# EAGLE design Main (EAGLE 9.6.2)

## Sheet 1 of 2
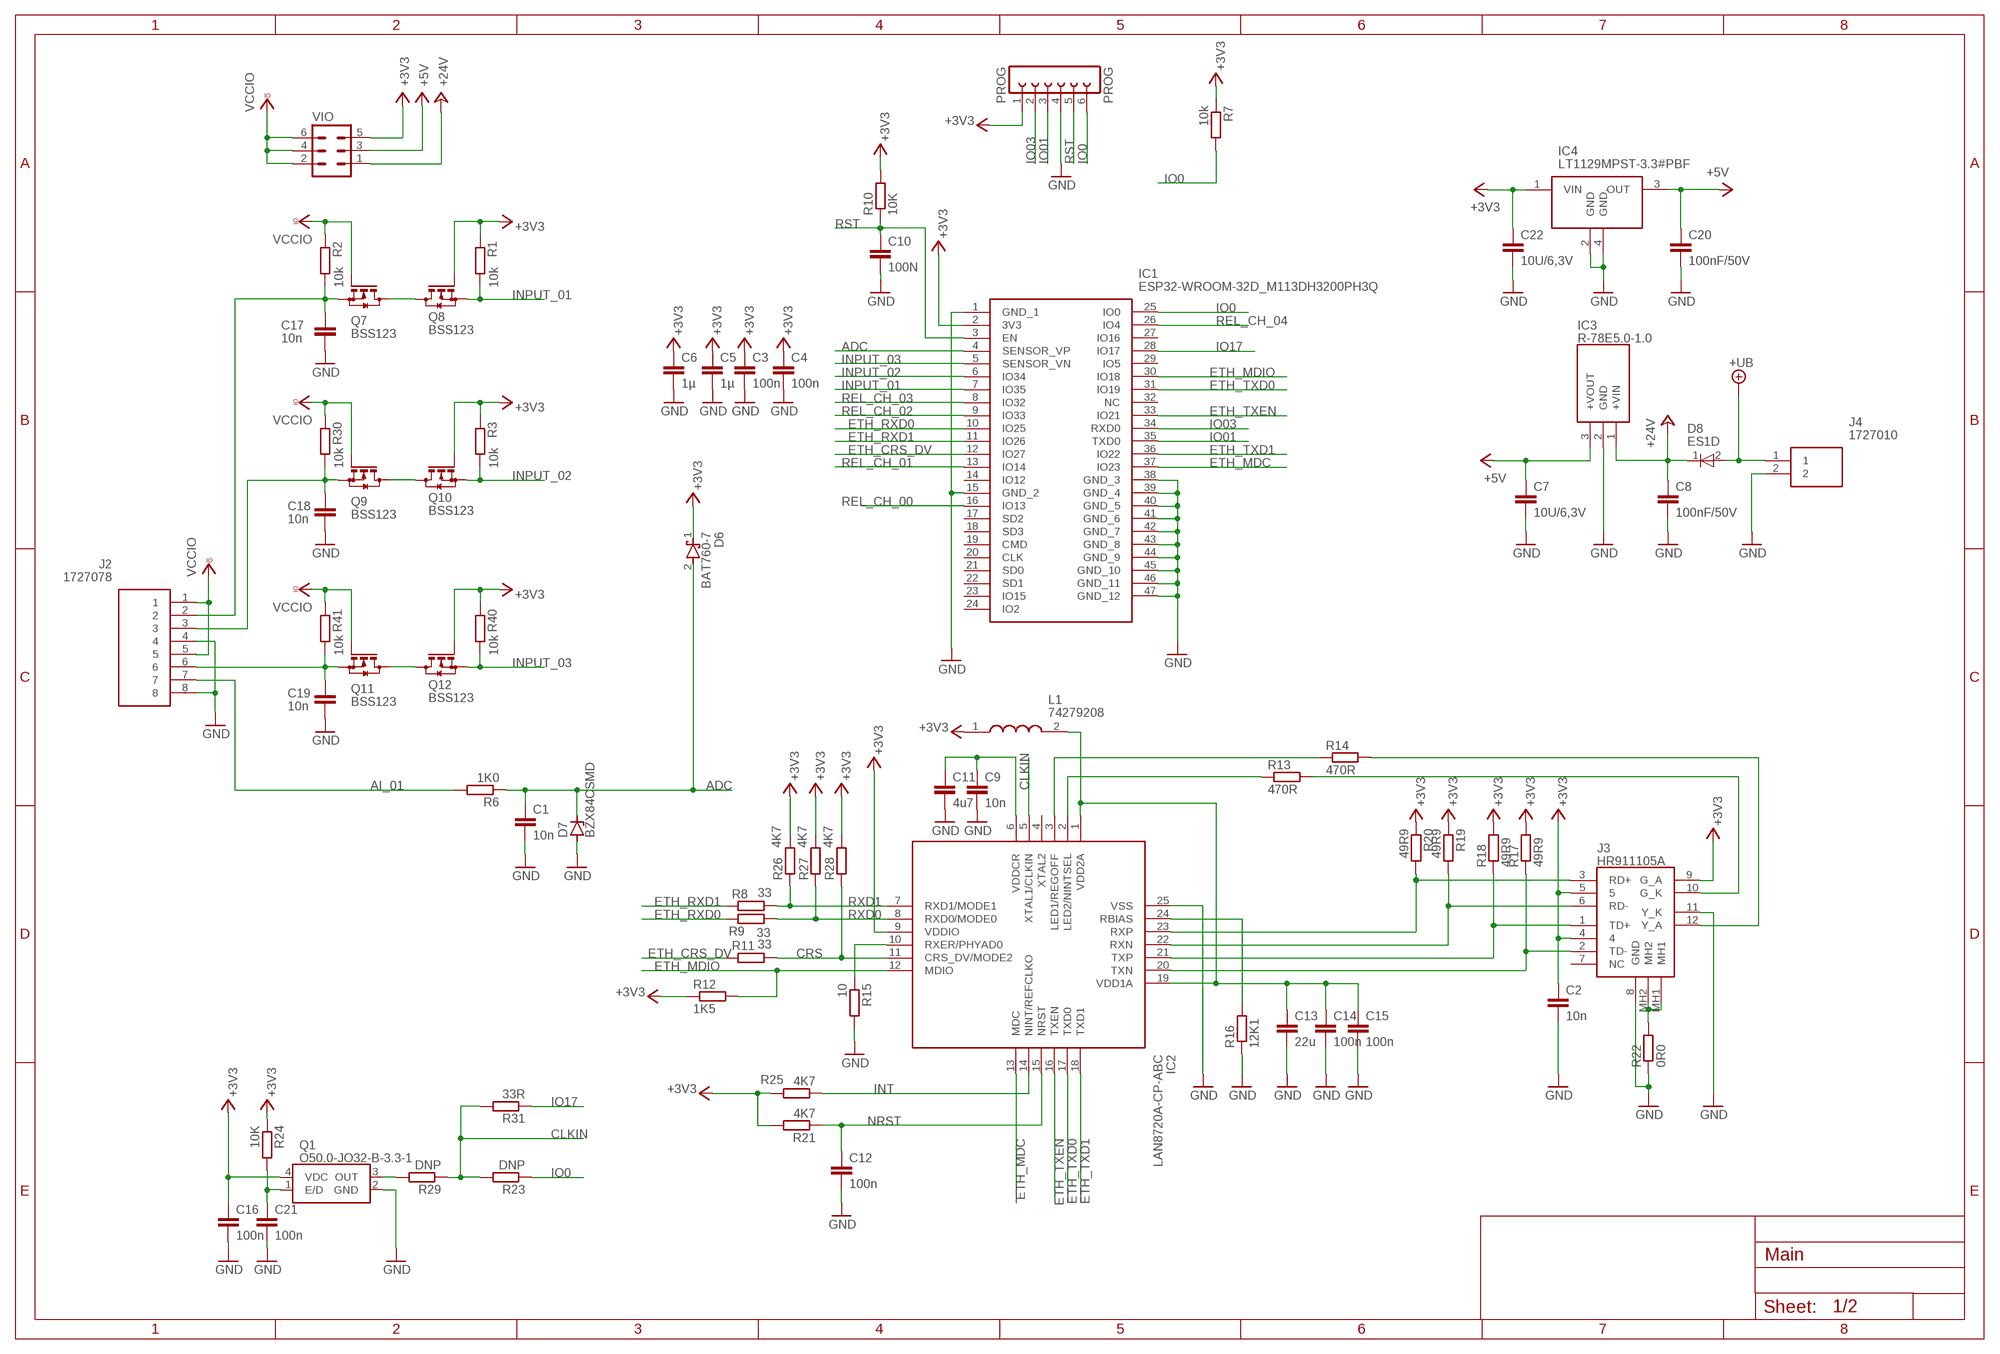
[diagram p0: schematic, sheet 1]

### Parts
C1  10n  C-EUC0603  [C0603]
C2  10n  C-EUC0603  [C0603]
C3  100n  C-EUC0603  [C0603]
C4  100n  C-EUC0603  [C0603]
C5  1µ  C-EUC0603  [C0603]
C6  1µ  C-EUC0603  [C0603]
C7  10U/6,3V  C-EUC0603  [C0603]
C8  100nF/50V  C-EUC0603  [C0603]
C9  10n  C-EUC0603  [C0603]
C10  100N  C-EUC0603  [C0603]
C11  4u7  C-EUC0603  [C0603]
C12  100n  C-EUC0603  [C0603]
C13  22u  C-EUC0603  [C0603]
C14  100n  C-EUC0603  [C0603]
C15  100n  C-EUC0603  [C0603]
C16  100n  C-EUC0603  [C0603]
C17  10n  C-EUC0603  [C0603]
C18  10n  C-EUC0603  [C0603]
C19  10n  C-EUC0603  [C0603]
C20  100nF/50V  C-EUC0603  [C0603]
C21  100n  C-EUC0603  [C0603]
C22  10U/6,3V  C-EUC0603  [C0603]
D6  BAT760-7  [SOD2513X120N]
D7  BZX84CSMD  [TO236]
D8  ES1D  ES1DL_R3G  [SODFL3618X143N]
IC1  ESP32-WROOM-32D_M113DH3200PH3Q  [ESP32WROOM32DM113DH3200PH3Q0]
IC2  LAN8720A-CP-ABC  [QFN50P400X400X100-25N]
IC3  R-78E5.0-1.0  R-78E3.3-1.0  [R78E3310]
IC4  LT1129MPST-3.3#PBF  [SOT230P700X180-4N]
J2  1727078  [1727078]
J3  HR911105A  [HR911105A]
J4  1727010  [1727010]
L1  74279208  [CAPC2012X90N]
PROG  PROG  FE06-1  [FE06]
Q1  O50.0-JO32-B-3.3-1  [O200JO32B1V31T1LF]
Q7  BSS123  [SOT23]
Q8  BSS123  [SOT23]
Q9  BSS123  [SOT23]
Q10  BSS123  [SOT23]
Q11  BSS123  [SOT23]
Q12  BSS123  [SOT23]
R1  10k  R-EU_R0603  [R0603]
R2  10k  R-EU_R0603  [R0603]
R3  10k  R-EU_R0603  [R0603]
R6  1K0  R-EU_R0603  [R0603]
R7  10k  R-EU_R0603  [R0603]
R8  33  R-EU_R0603  [R0603]
R9  33  R-EU_R0603  [R0603]
R10  10K  R-EU_R0603  [R0603]
R11  33  R-EU_R0603  [R0603]
R12  1K5  R-EU_R0603  [R0603]
R13  470R  R-EU_R0603  [R0603]
R14  470R  R-EU_R0603  [R0603]
R15  10  R-EU_R0603  [R0603]
R16  12K1  R-EU_R0603  [R0603]
R17  49R9  R-EU_R0603  [R0603]
R18  49R9  R-EU_R0603  [R0603]
R19  49R9  R-EU_R0603  [R0603]
R20  49R9  R-EU_R0603  [R0603]
R21  4K7  R-EU_R0603  [R0603]
R22  0R0  R-EU_R0603  [R0603]
R23  DNP  R-EU_R0603  [R0603]
R24  10K  R-EU_R0603  [R0603]
R25  4K7  R-EU_R0603  [R0603]
R26  4K7  R-EU_R0603  [R0603]
R27  4K7  R-EU_R0603  [R0603]
R28  4K7  R-EU_R0603  [R0603]
R29  DNP  R-EU_R0603  [R0603]
R30  10k  R-EU_R0603  [R0603]
R31  33R  R-EU_R0603  [R0603]
R40  10k  R-EU_R0603  [R0603]
R41  10k  R-EU_R0603  [R0603]
VIO  MA03-2  [MA03-2]

### Nets
+3V3: C2.1 C3.1 C4.1 C5.1 C6.1 C16.1 C22.1 D6.1(K) IC1.2(3V3) IC2.9(VDDIO) IC4.1(VIN) J3.4 J3.5 J3.9(G_A) L1.1 PROG.1 Q1.4(VDC) Q8.1(G) Q10.1(G) Q12.1(G) R1.1 R3.1 R7.1 R10.2 R12.1 R17.2 R18.2 R19.1 R20.1 R21.2 R24.1 R25.2 R26.2 R27.2 R28.2 R40.1 VIO.5
+5V: C7.1 C20.1 IC3.3(+VOUT) IC4.3(OUT) VIO.3 ; also sheet 2
+24V: C8.1 D8.1(K) IC3.1(+VIN) VIO.1
+UB: D8.2(A) J4.1 ; also sheet 2
ADC: C1.1 D6.2(A) D7.C IC1.4(SENSOR_VP) R6.1
AI_01: J2.7 R6.2
CLKIN: IC2.5(XTAL1/CLKIN) R23.2 R29.1 R31.2
CRS: IC2.11(CRS_DV/MODE2) R11.2 R28.1
ETH_CRS_DV: IC1.12(IO27) R11.1
ETH_MDC: IC1.37(IO23) IC2.13(MDC)
ETH_MDIO: IC1.30(IO18) IC2.12(MDIO) R12.2
ETH_PHY_PWR: C21.1 Q1.1(E/D) R24.2
ETH_RXD0: IC1.10(IO25) R9.1
ETH_RXD1: IC1.11(IO26) R8.1
ETH_TXD0: IC1.31(IO19) IC2.17(TXD0)
ETH_TXD1: IC1.36(IO22) IC2.18(TXD1)
ETH_TXEN: IC1.33(IO21) IC2.16(TXEN)
GND: C1.2 C2.2 C3.2 C4.2 C5.2 C6.2 C7.2 C8.2 C9.2 C10.2 C11.2 C12.2 C13.2 C14.2 C15.2 C16.2 C17.2 C18.2 C19.2 C20.2 C21.2 C22.2 D7.A IC1.1(GND_1) IC1.15(GND_2) IC1.38(GND_3) IC1.39(GND_4) IC1.40(GND_5) IC1.41(GND_6) IC1.42(GND_7) IC1.43(GND_8) IC1.44(GND_9) IC1.45(GND_10) IC1.46(GND_11) IC1.47(GND_12) IC2.25(VSS) IC3.2(GND) IC4.2(GND) IC4.4(GND.) J2.4 J2.8 J3.8(GND) J3.11(Y_K) J4.2 PROG.4 Q1.2(GND) R15.2 R16.1 R22.1 ; also sheet 2
INPUT_01: IC1.7(IO35) Q8.2(S) R1.2
INPUT_02: IC1.6(IO34) Q10.2(S) R3.2
INPUT_03: IC1.5(SENSOR_VN) Q12.2(S) R40.2
INT: IC2.14(NINT/REFCLKO) R25.1
IO0: IC1.25(IO0) PROG.6 R7.2 R23.1
IO01: IC1.35(TXD0) PROG.3
IO03: IC1.34(RXD0) PROG.2
IO17: IC1.28(IO17) R31.1
N$2: IC2.20(TXN) J3.2(TD-) R17.1
N$3: IC2.22(RXN) J3.6(RD-) R19.2
N$4: IC2.23(RXP) J3.3(RD+) R20.2
N$5: J3.12(Y_A) R14.2
N$6: J3.10(G_K) R13.2
N$8: Q1.3(OUT) R29.2
N$9: J3.MH1 J3.MH2 R22.2
N$13: Q7.3(D) Q8.3(D)
N$14: Q9.3(D) Q10.3(D)
N$16: C17.1 J2.2 Q7.2(S) R2.2
N$18: C13.1 C14.1 C15.1 IC2.1(VDD2A) IC2.19(VDD1A) L1.2
N$19: C9.1 C11.1 IC2.6(VDDCR)
N$20: IC2.2(LED2/NINTSEL) R13.1
N$21: IC2.3(LED1/REGOFF) R14.1
N$22: IC2.10(RXER/PHYAD0) R15.1
N$23: IC2.21(TXP) J3.1(TD+) R18.1
N$24: IC2.24(RBIAS) R16.2
N$26: C18.1 J2.3 Q9.2(S) R30.2
N$29: Q11.3(D) Q12.3(D)
N$30: C19.1 J2.6 Q11.2(S) R41.2
NRST: C12.1 IC2.15(NRST) R21.1
REL_CH_00: IC1.16(IO13) ; also sheet 2
REL_CH_01: IC1.13(IO14) ; also sheet 2
REL_CH_02: IC1.9(IO33) ; also sheet 2
REL_CH_03: IC1.8(IO32) ; also sheet 2
REL_CH_04: IC1.26(IO4) ; also sheet 2
RST: C10.1 IC1.3(EN) PROG.5 R10.1
RXD0: IC2.8(RXD0/MODE0) R9.2 R27.1
RXD1: IC2.7(RXD1/MODE1) R8.2 R26.1
VCCIO: J2.1 J2.5 Q7.1(G) Q9.1(G) Q11.1(G) R2.1 R30.1 R41.1 VIO.2 VIO.4 VIO.6
Unconnected: IC1.14(IO12) IC1.17(SD2) IC1.18(SD3) IC1.19(CMD) IC1.20(CLK) IC1.21(SD0) IC1.22(SD1) IC1.23(IO15) IC1.24(IO2) IC1.27(IO16) IC1.29(IO5) IC1.32(NC) IC2.4(XTAL2) J3.7(NC)

## Sheet 2 of 2
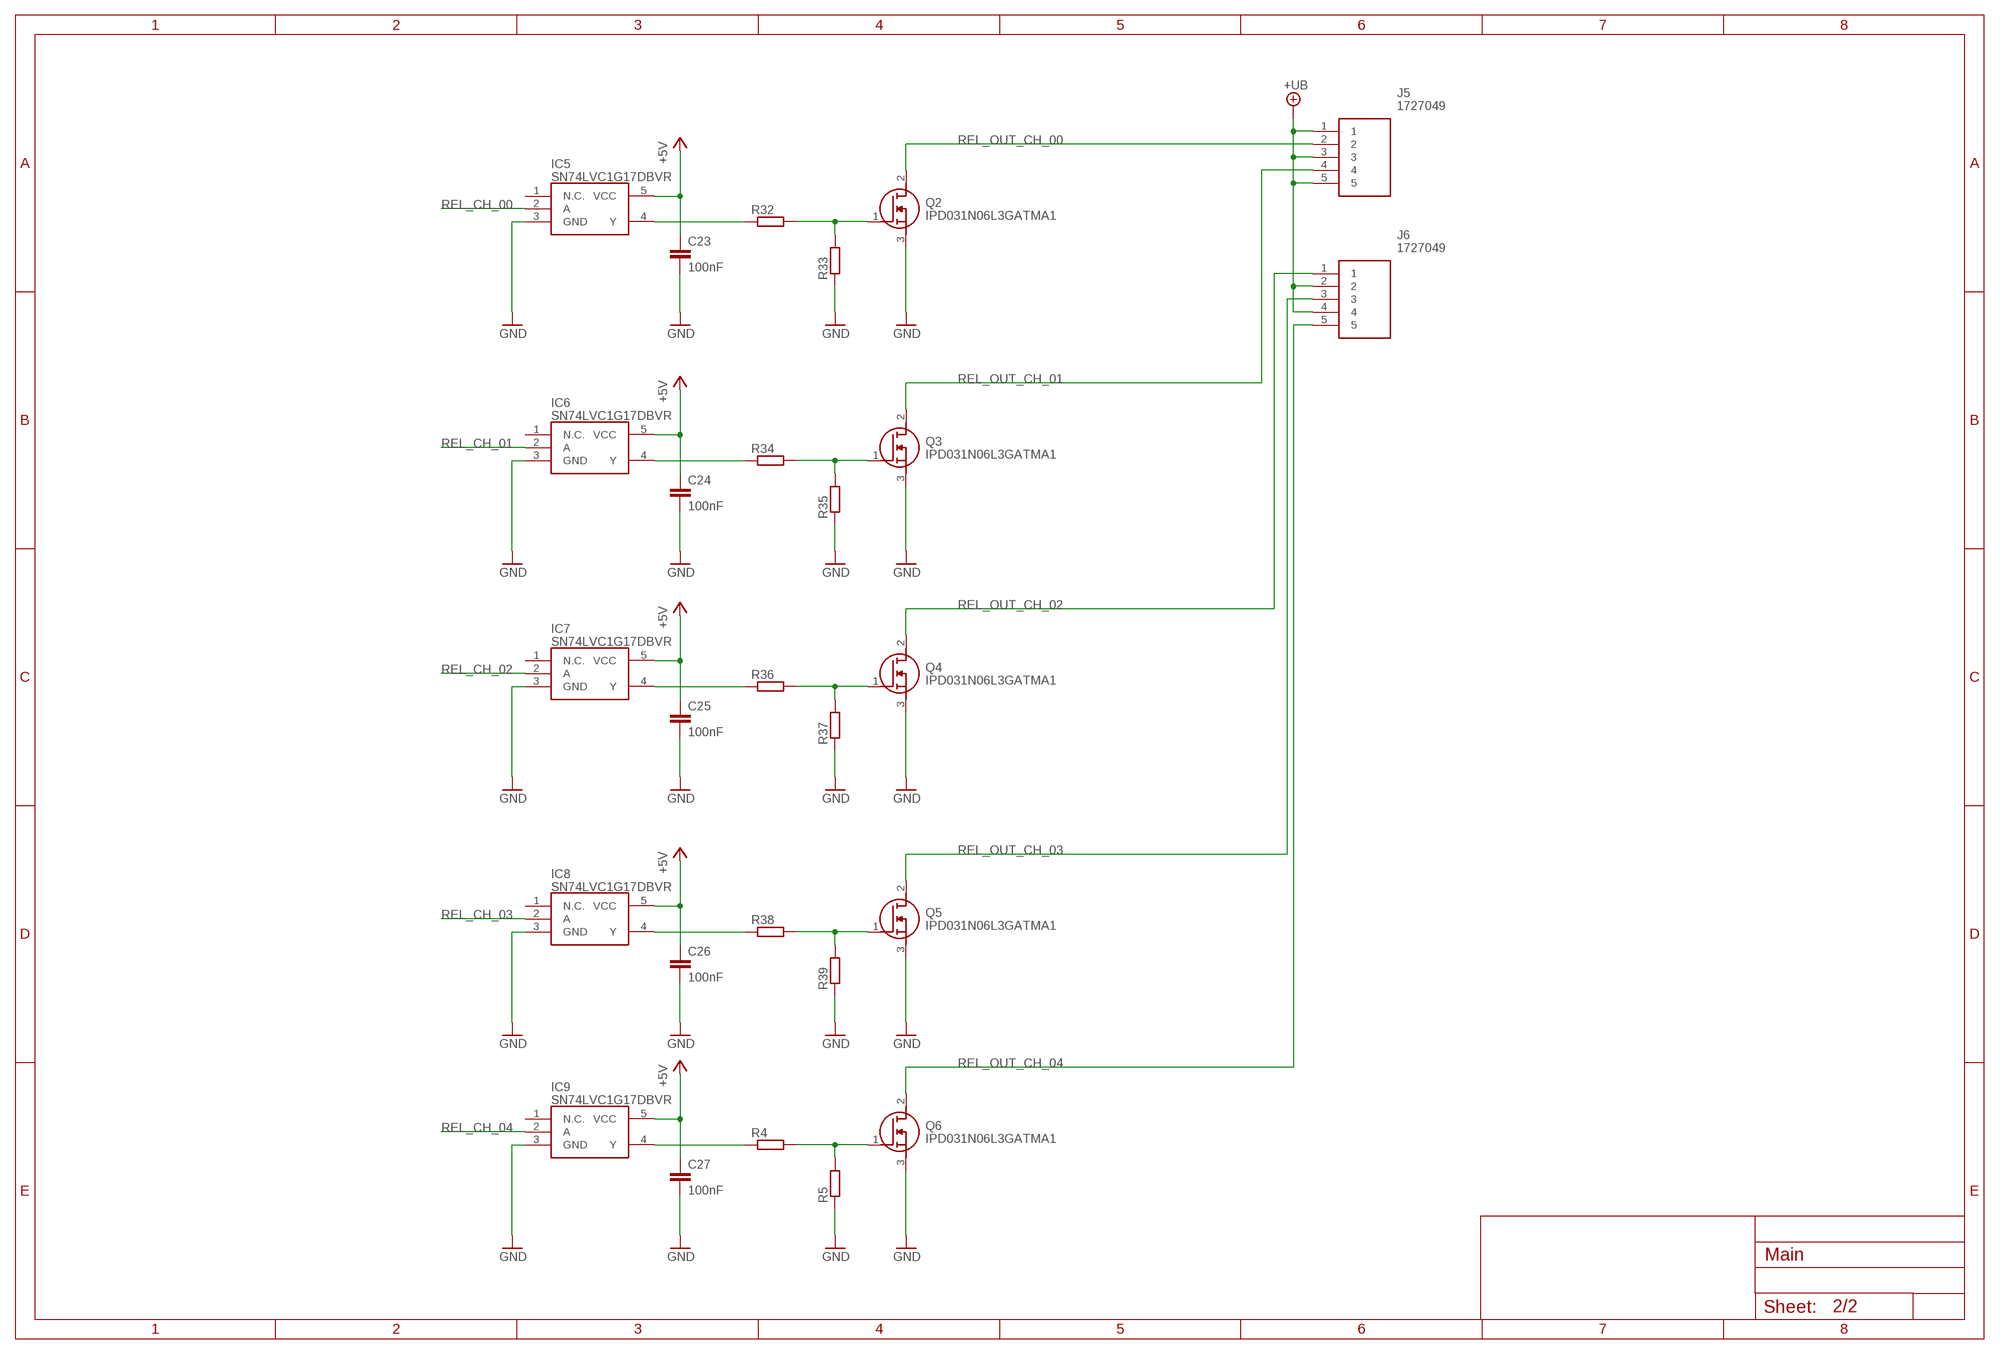
[diagram p1: schematic, sheet 2]

### Parts
C23  100nF  C-EUC0603  [C0603]
C24  100nF  C-EUC0603  [C0603]
C25  100nF  C-EUC0603  [C0603]
C26  100nF  C-EUC0603  [C0603]
C27  100nF  C-EUC0603  [C0603]
IC5  SN74LVC1G17DBVR  [SOT95P280X145-5N]
IC6  SN74LVC1G17DBVR  [SOT95P280X145-5N]
IC7  SN74LVC1G17DBVR  [SOT95P280X145-5N]
IC8  SN74LVC1G17DBVR  [SOT95P280X145-5N]
IC9  SN74LVC1G17DBVR  [SOT95P280X145-5N]
J5  1727049  [1727049]
J6  1727049  [1727049]
Q2  IPD031N06L3GATMA1  [IPD031N06L3GATMA1]
Q3  IPD031N06L3GATMA1  [IPD031N06L3GATMA1]
Q4  IPD031N06L3GATMA1  [IPD031N06L3GATMA1]
Q5  IPD031N06L3GATMA1  [IPD031N06L3GATMA1]
Q6  IPD031N06L3GATMA1  [IPD031N06L3GATMA1]
R4  R-EU_R0603  [R0603]
R5  R-EU_R0603  [R0603]
R32  R-EU_R0603  [R0603]
R33  R-EU_R0603  [R0603]
R34  R-EU_R0603  [R0603]
R35  R-EU_R0603  [R0603]
R36  R-EU_R0603  [R0603]
R37  R-EU_R0603  [R0603]
R38  R-EU_R0603  [R0603]
R39  R-EU_R0603  [R0603]

### Nets
+5V: C23.1 C24.1 C25.1 C26.1 C27.1 IC5.5(VCC) IC6.5(VCC) IC7.5(VCC) IC8.5(VCC) IC9.5(VCC) ; also sheet 1
+UB: J5.1 J5.3 J5.5 J6.2 J6.4 ; also sheet 1
GND: C23.2 C24.2 C25.2 C26.2 C27.2 IC5.3(GND) IC6.3(GND) IC7.3(GND) IC8.3(GND) IC9.3(GND) Q2.3(S) Q3.3(S) Q4.3(S) Q5.3(S) Q6.3(S) R5.1 R33.1 R35.1 R37.1 R39.1 ; also sheet 1
N$1: IC5.4(Y) R32.1
N$7: IC6.4(Y) R34.1
N$10: IC7.4(Y) R36.1
N$11: Q6.1(G) R4.2 R5.2
N$12: Q2.1(G) R32.2 R33.2
N$15: Q3.1(G) R34.2 R35.2
N$17: IC8.4(Y) R38.1
N$25: Q4.1(G) R36.2 R37.2
N$28: Q5.1(G) R38.2 R39.2
N$32: IC9.4(Y) R4.1
REL_CH_00: IC5.2(A) ; also sheet 1
REL_CH_01: IC6.2(A) ; also sheet 1
REL_CH_02: IC7.2(A) ; also sheet 1
REL_CH_03: IC8.2(A) ; also sheet 1
REL_CH_04: IC9.2(A) ; also sheet 1
REL_OUT_CH_00: J5.2 Q2.2(D)
REL_OUT_CH_01: J5.4 Q3.2(D)
REL_OUT_CH_02: J6.1 Q4.2(D)
REL_OUT_CH_03: J6.3 Q5.2(D)
REL_OUT_CH_04: J6.5 Q6.2(D)
Unconnected: IC5.1(N.C.) IC6.1(N.C.) IC7.1(N.C.) IC8.1(N.C.) IC9.1(N.C.)

## Library data of the parts
C1-C27 = rcl:C-EU: CAPACITOR, European symbol; SPICEPREFIX: C
D6 = SamacSys_Parts:BAT760-7: Diode Schottky 30V 1A 2Pin SOD323 Diodes Inc BAT760-7, SMT Schottky Diode, 30V 1A, 2-Pin SOD-323 Source: Datasheet <https://www.diodes.com/assets/Datasheets/ds30498.pdf>; ARROW_PART_NUMBER: BAT760-7; ARROW_PRICE-STOCK: https://www.arrow.com/en/products/bat760-7/diodes-incorporated; DESCRIPTION: Diode Schottky 30V 1A 2Pin SOD323 Diodes Inc BAT760-7, SMT Schottky Diode, 30V 1A, 2-Pin SOD-323; HEIGHT: 1.2mm; MANUFACTURER_NAME: Diodes Inc.; MANUFACTURER_PART_NUMBER: BAT760-7; MOUSER_PART_NUMBER: 621-BAT760-7; MOUSER_PRICE-STOCK: https://www.mouser.co.uk/ProductDetail/Diodes-Incorporated/BAT760-7?qs=JV7lzlMm3yKDDyO09xoRbQ%3D%3D
D7 = diode:BZX84CSMD: Z DIODE
D8 = SamacSys_Parts:ES1DL_R3G: TAIWAN SEMICONDUCTOR - ES1DL R3G - DIODE, ULTRA-FAST SMF 1A 200V Source: Datasheet <https://mouser.componentsearchengine.com/Datasheets/2/ES1DL R3G.pdf>; ARROW_PART_NUMBER: ES1DL R3G; ARROW_PRICE-STOCK: https://www.arrow.com/en/products/es1dlr3g/taiwan-semiconductor?region=nac; DESCRIPTION: TAIWAN SEMICONDUCTOR - ES1DL R3G - DIODE, ULTRA-FAST SMF 1A 200V; HEIGHT: 1.43mm; MANUFACTURER_NAME: Taiwan Semiconductor; MANUFACTURER_PART_NUMBER: ES1DL R3G; MOUSER_PART_NUMBER: 821-ES1DLR3G; MOUSER_PRICE-STOCK: https://www.mouser.co.uk/ProductDetail/Taiwan-Semiconductor/ES1DL-R3G?qs=70cth9uAySeVkK%252BhDJIsVg%3D%3D
IC1 = SamacSys_Parts:ESP32-WROOM-32D_M113DH3200PH3Q: WiFi Modules (802.11) SMD Module, ESP32-D0WD, 32Mbits SPI flash, UART mode, PCB antenna Source: Datasheet <https://www.mouser.in/datasheet/2/891/esp32-wroom-32d_esp32-wroom-32u_datasheet_en-1365844.pdf>; DESCRIPTION: WiFi Modules (802.11) SMD Module, ESP32-D0WD, 32Mbits SPI flash, UART mode, PCB antenna; HEIGHT: 3.2mm; MANUFACTURER_NAME: Espressif Systems; MANUFACTURER_PART_NUMBER: ESP32-WROOM-32D(M113DH3200PH3Q0); MOUSER_PART_NUMBER: 356-ESP32WROOM-32D; MOUSER_PRICE-STOCK: https://www.mouser.co.uk/ProductDetail/Espressif-Systems/ESP32-WROOM-32DM113DH3200PH3Q0?qs=W%2FMpXkg%252BdQ5YcAmhj3kVpA%3D%3D
IC2 = SamacSys_Parts:LAN8720A-CP-ABC: Ethernet ICs Small Footprint RMII RMII 10/100 Ethernet Source: Datasheet <http://ww1.microchip.com/downloads/en/DeviceDoc/00002165B.pdf>; ARROW_PART_NUMBER: LAN8720A-CP-ABC; ARROW_PRICE-STOCK: https://www.arrow.com/en/products/lan8720a-cp-abc/microchip-technology?region=nac; DESCRIPTION: Ethernet ICs Small Footprint RMII RMII 10/100 Ethernet; HEIGHT: 1mm; MANUFACTURER_NAME: Microchip; MANUFACTURER_PART_NUMBER: LAN8720A-CP-ABC; MOUSER_PART_NUMBER: 579-LAN8720ACPABC; MOUSER_PRICE-STOCK: https://www.mouser.co.uk/ProductDetail/Microchip-Technology/LAN8720A-CP-ABC?qs=Gd3Cm49KlLPCUEGQe1b4LA%3D%3D
IC3 = SamacSys_Parts:R-78E3.3-1.0: Recom DC-DC Switching Regulator, 7 28V dc Input, 3.3V Output, 1A Source: Datasheet <https://componentsearchengine.com/Datasheets/1/R-78E3.3-1.0.pdf>; ARROW_PART_NUMBER: R-78E3.3-1.0; ARROW_PRICE-STOCK: https://www.arrow.com/en/products/r-78e3.3-1.0/recom-power; DESCRIPTION: Recom DC-DC Switching Regulator, 7 28V dc Input, 3.3V Output, 1A; HEIGHT: 10.9mm; MANUFACTURER_NAME: RECOM Power; MANUFACTURER_PART_NUMBER: R-78E3.3-1.0; MOUSER_PART_NUMBER: 919-R-78E3.3-1.0; MOUSER_PRICE-STOCK: https://www.mouser.co.uk/ProductDetail/RECOM-Power/R-78E33-10/?qs=D0iH%252BVFiYPOgLjjtWWnV0Q%3D%3D
IC4 = SamacSys_Parts:LT1129MPST-3.3#PBF: LDO Voltage Regulators 700mA Micropower Low Dropout Regulator with Shutdown Source: Datasheet <https://www.analog.com/media/en/technical-documentation/data-sheets/112935ff.pdf>; DESCRIPTION: LDO Voltage Regulators 700mA Micropower Low Dropout Regulator with Shutdown; HEIGHT: 1.8mm; MANUFACTURER_NAME: Linear Technology; MANUFACTURER_PART_NUMBER: LT1129MPST-3.3#PBF; MOUSER_PART_NUMBER: 584-1129MPST-3.3PBF; MOUSER_PRICE-STOCK: https://www.mouser.com/Search/Refine.aspx?Keyword=584-1129MPST-3.3PBF
IC5-IC9 = SamacSys_Parts:SN74LVC1G17DBVR: SINGLE SCHMITT-TRIGGER BUFFER Source: Datasheet <http://www.ti.com/lit/gpn/sn74lvc1g17>; ARROW_PART_NUMBER: SN74LVC1G17DBVR; ARROW_PRICE-STOCK: https://www.arrow.com/en/products/sn74lvc1g17dbvr/texas-instruments; DESCRIPTION: SINGLE SCHMITT-TRIGGER BUFFER; HEIGHT: 1.45mm; MANUFACTURER_NAME: Texas Instruments; MANUFACTURER_PART_NUMBER: SN74LVC1G17DBVR; MOUSER_PART_NUMBER: 595-SN74LVC1G17DBVR; MOUSER_PRICE-STOCK: https://www.mouser.co.uk/ProductDetail/Texas-Instruments/SN74LVC1G17DBVR?qs=fvkeCqCHl3BQIcdbAa1fbQ%3D%3D
J2 = SamacSys_Parts:1727078: Fixed Terminal Blocks 8P 3.81mm 90DEG Source: Datasheet <https://componentsearchengine.com/Datasheets/2/1727078.pdf>; ARROW_PART_NUMBER: 1727078; ARROW_PRICE-STOCK: https://www.arrow.com/en/products/1727078/phoenix-contact; DESCRIPTION: Fixed Terminal Blocks 8P 3.81mm 90DEG; HEIGHT: 8.65mm; MANUFACTURER_NAME: Phoenix Contact; MANUFACTURER_PART_NUMBER: 1727078; MOUSER_PART_NUMBER: 651-1727078; MOUSER_PRICE-STOCK: https://www.mouser.co.uk/ProductDetail/Phoenix-Contact/1727078/?qs=JcjeNNoqGSNsjTv9gJgF1A%3D%3D
J3 = SamacSys_Parts:HR911105A: Ethernet Connectors/Modular Connectors (RJ45 RJ11) DIP RoHS Source: Datasheet <https://datasheet.lcsc.com/szlcsc/Zhongshan-HanRun-Elec-HR911105A_C12074.pdf>; DESCRIPTION: Ethernet Connectors/Modular Connectors (RJ45 RJ11) DIP RoHS; HEIGHT: 13.75mm; MANUFACTURER_NAME: Hanrun Electronics; MANUFACTURER_PART_NUMBER: HR911105A
J4 = SamacSys_Parts:1727010: Conn PC Terminal Block 2 POS 3.81mm Solder ST Thru-Hole 13.5A Source: Datasheet <https://datasheet.datasheetarchive.com/originals/distributors/SFDatasheet-2/sf-00050638.pdf>; ARROW_PART_NUMBER: 1727010; ARROW_PRICE-STOCK: https://www.arrow.com/en/products/1727010/phoenix-contact?region=nac; DESCRIPTION: Conn PC Terminal Block 2 POS 3.81mm Solder ST Thru-Hole 13.5A; HEIGHT: 8.65mm; MANUFACTURER_NAME: Phoenix Contact; MANUFACTURER_PART_NUMBER: 1727010; MOUSER_PART_NUMBER: 651-1727010; MOUSER_PRICE-STOCK: https://www.mouser.co.uk/ProductDetail/Phoenix-Contact/1727010?qs=JcjeNNoqGSMjtHhQoBJ7UA%3D%3D
J5 J6 = SamacSys_Parts:1727049: Fixed Terminal Blocks 5P 3.81mm 90DEG Source: Datasheet <https://componentsearchengine.com/Datasheets/2/1727049.pdf>; ARROW_PART_NUMBER: 1727049; ARROW_PRICE-STOCK: https://www.arrow.com/en/products/1727049/phoenix-contact?region=nac; DESCRIPTION: Fixed Terminal Blocks 5P 3.81mm 90DEG; HEIGHT: 8.65mm; MANUFACTURER_NAME: Phoenix Contact; MANUFACTURER_PART_NUMBER: 1727049; MOUSER_PART_NUMBER: 651-1727049; MOUSER_PRICE-STOCK: https://www.mouser.co.uk/ProductDetail/Phoenix-Contact/1727049?qs=WWq3Ki8dym42eifCXpCGkQ%3D%3D
L1 = SamacSys_Parts:74279208: SMD EMI Suppression Ferrite Beads WE-CBF Source: Datasheet; DESCRIPTION: SMD EMI Suppression Ferrite Beads WE-CBF; HEIGHT: 0.9mm; MANUFACTURER_NAME: Wurth Elektronik; MANUFACTURER_PART_NUMBER: 74279208; MOUSER_PART_NUMBER: 710-74279208; MOUSER_PRICE-STOCK: https://www.mouser.co.uk/ProductDetail/Wurth-Elektronik/74279208?qs=2kOmHSv6VfSoTnc9ejLZaA%3D%3D
PROG = con-lsta:FE06-1: FEMALE HEADER; OC_FARNELL: unknown; OC_NEWARK: unknown
Q1 = SamacSys_Parts:O50.0-JO32-B-3.3-1
Q2-Q6 = SamacSys_Parts:IPD031N06L3GATMA1: MOSFET N-Ch 60V 100A DPAK-2 OptiMOS 3 Source: Datasheet <https://datasheet.datasheetarchive.com/originals/dk/DKDS-30/599831.pdf>; ARROW_PART_NUMBER: IPD031N06L3GATMA1; ARROW_PRICE-STOCK: https://www.arrow.com/en/products/ipd031n06l3gatma1/infineon-technologies-ag; DESCRIPTION: MOSFET N-Ch 60V 100A DPAK-2 OptiMOS 3; HEIGHT: 2.563mm; MANUFACTURER_NAME: Infineon; MANUFACTURER_PART_NUMBER: IPD031N06L3GATMA1; MOUSER_PART_NUMBER: 726-IPD031N06L3GATMA; MOUSER_PRICE-STOCK: https://www.mouser.co.uk/ProductDetail/Infineon-Technologies/IPD031N06L3GATMA1/?qs=OwbwYO03UsJYrPy01%2FpZig%3D%3D
Q7-Q12 = transistor-small-signal:BSS123: N-CHANNEL MOS FET
R1-R41 = rcl:R-EU_: RESISTOR, European symbol; SPICEPREFIX: R
VIO = con-lstb:MA03-2: PIN HEADER; OC_FARNELL: unknown; OC_NEWARK: unknown

## Board
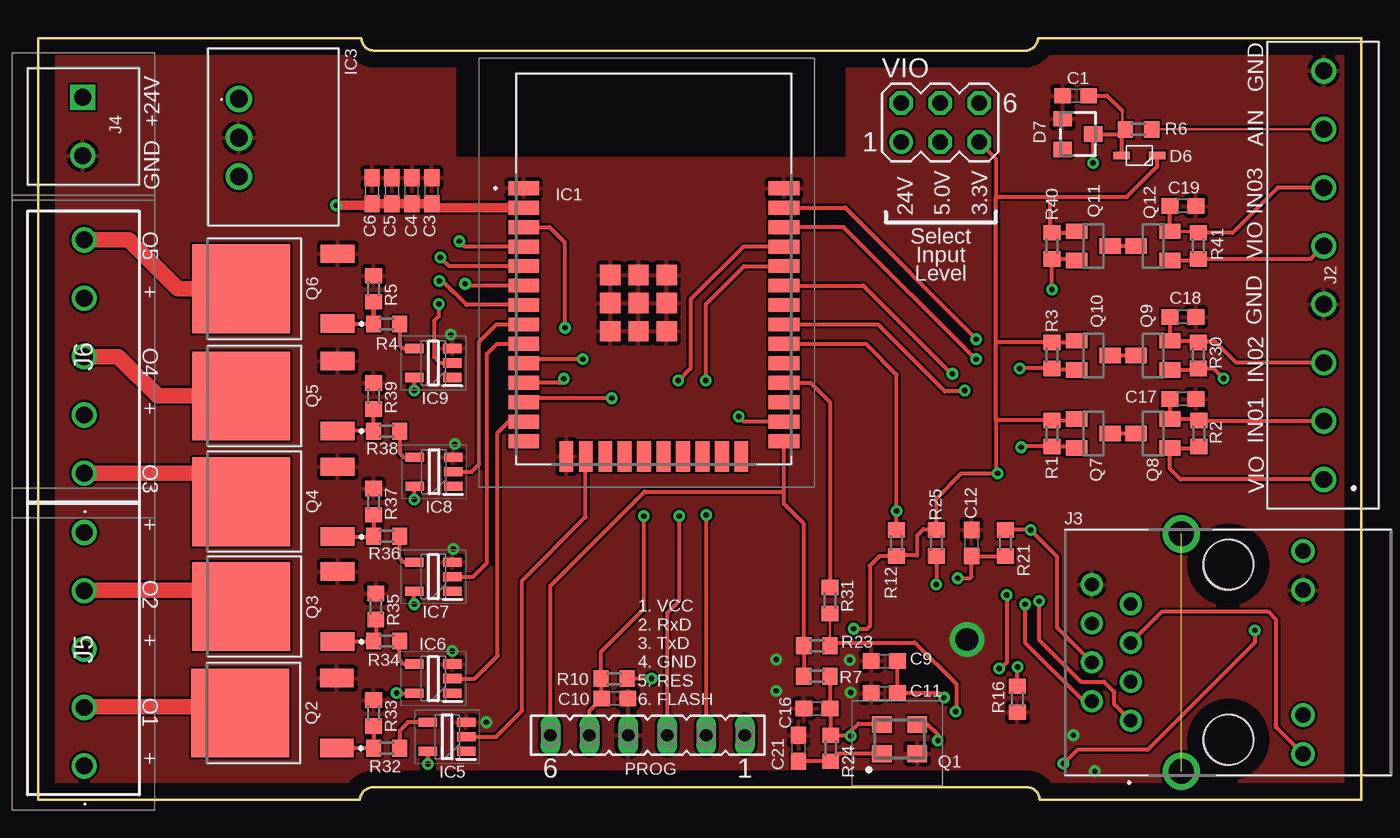
[diagram p2: board, top side]
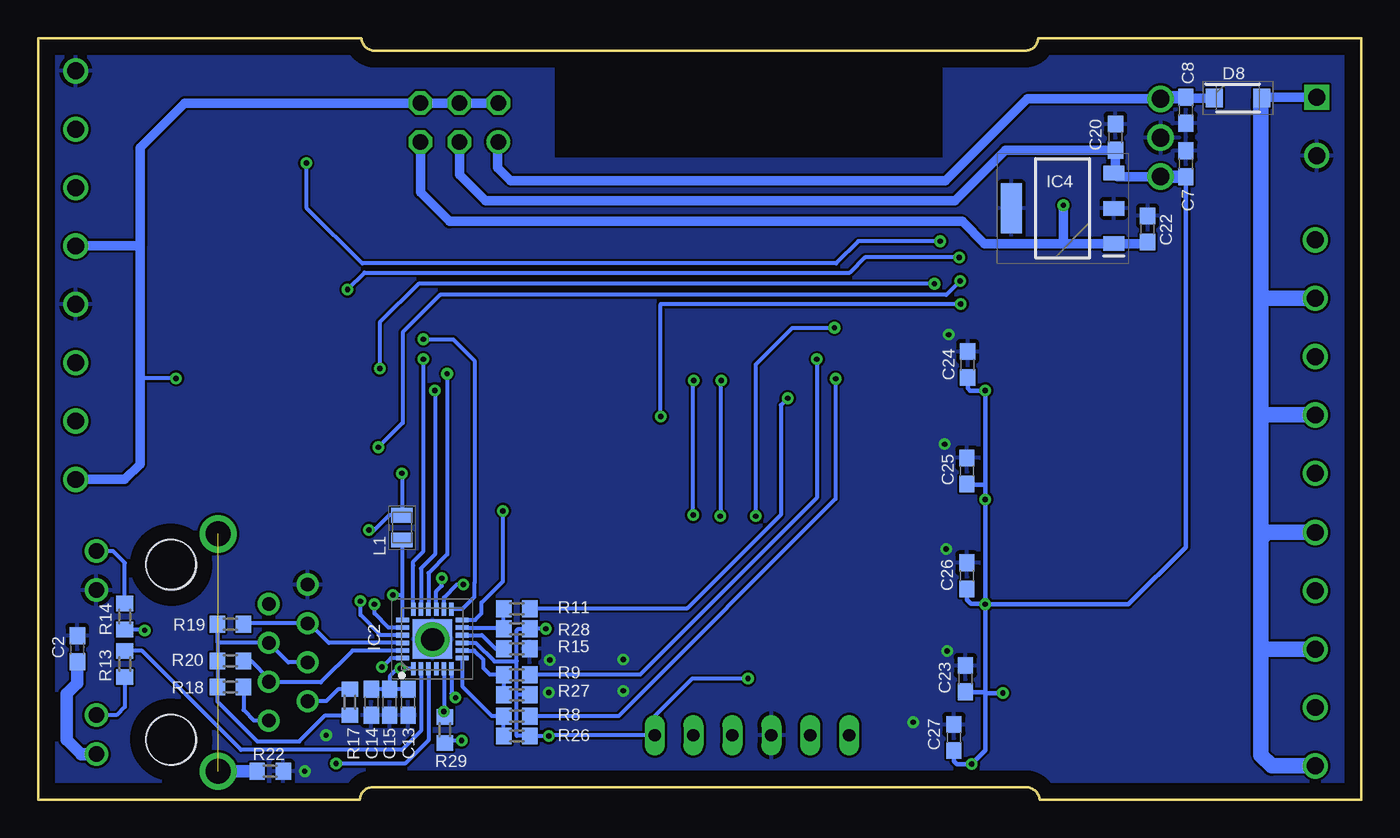
[diagram p3: board, bottom side, seen from below]

Size 86.4 x 49.7 mm. Coordinates in mm from the lower left corner, seen from the top.
Outline: 21.1,49.7 0,49.7 0,0 21,0 21.01,0.05 arc-90 22.1,0.8 64.3,0.8 64.42,0.8 arc-95 65.4,0 86.4,0 86.4,49.7 65.3,49.7 65.3,49.66 arc-90 64.3,48.9 22.1,48.9 21.96,48.9 arc-90 21.1,49.7
Copper layers (1*16): Top 0.035mm / dielectric 1.5mm / Bottom 0.035mm
Design rules "default": minimum track width 6mil, minimum drill 0.35mm, track to track 6mil, track to pad 6mil, pad to pad 6mil, via to via 6mil, smd to smd 6mil, copper to edge 40mil, drill to drill 6mil, minimum pad ring 10mil, minimum via ring 8mil, stop-mask expansion 4mil, vias tented up to drill 0mil, thermal gap 10mil
Holes 3.25 mm at 77.75,3.93 77.75,15.36
tKeepout: area 9.4,0 to 11.8,31.7; area 74.5,0 to 76.9,31.7

### Footprints (pad centres in the part's own frame; a part is rotated, then mirrored left to right if it is on the bottom)
C0603 = smd 1.1 x 1: 1 -0.85,0; 2 0.85,0
SOD2513X120N = smd 1.075 x 0.5: 1 -1.162,0; 2 1.162,0
TO236 = smd 1 x 1.2: A -1,-1; C 0,1; NC 1,-1
SODFL3618X143N = smd 1.12 x 1.22: 1 -1.55,0; 2 1.55,0
ESP32WROOM32DM113DH3200PH3Q0 = smd 2 x 0.9: 1 -8.5,5.26; 2 -8.5,3.99; 3 -8.5,2.72; 4 -8.5,1.45; 5 -8.5,0.18; 6 -8.5,-1.09; 7 -8.5,-2.36; 8 -8.5,-3.63; 9 -8.5,-4.9; 10 -8.5,-6.17; 11 -8.5,-7.44; 12 -8.5,-8.71; 13 -8.5,-9.98; 14 -8.5,-11.25; 25 8.5,-11.25; 26 8.5,-9.98; 27 8.5,-8.71; 28 8.5,-7.44; 29 8.5,-6.17; 30 8.5,-4.9; 31 8.5,-3.63; 32 8.5,-2.36; 33 8.5,-1.09; 34 8.5,0.18; 35 8.5,1.45; 36 8.5,2.72; 37 8.5,3.99; 38 8.5,5.26 | smd 0.9 x 2: 15 -5.715,-12.25; 16 -4.445,-12.25; 17 -3.175,-12.25; 18 -1.905,-12.25; 19 -0.635,-12.25; 20 0.635,-12.25; 21 1.905,-12.25; 22 3.175,-12.25; 23 4.445,-12.25; 24 5.715,-12.25 | smd 1.33 x 1.33: 39 -2.835,-0.405; 40 -2.835,-2.24; 41 -2.835,-4.075; 42 -1,-4.075; 43 0.835,-4.075; 44 0.835,-2.24; 45 0.835,-0.405; 46 -1,-0.405; 47 -1,-2.24
QFN50P400X400X100-25N = smd 0.85 x 0.3: 1 -1.95,1.25; 2 -1.95,0.75; 3 -1.95,0.25; 4 -1.95,-0.25; 5 -1.95,-0.75; 6 -1.95,-1.25; 13 1.95,-1.25; 14 1.95,-0.75; 15 1.95,-0.25; 16 1.95,0.25; 17 1.95,0.75; 18 1.95,1.25 | smd 0.3 x 0.85: 7 -1.25,-1.95; 8 -0.75,-1.95; 9 -0.25,-1.95; 10 0.25,-1.95; 11 0.75,-1.95; 12 1.25,-1.95; 19 1.25,1.95; 20 0.75,1.95; 21 0.25,1.95; 22 -0.25,1.95; 23 -0.75,1.95; 24 -1.25,1.95 | smd 2.6 x 2.6: 25 0,0
R78E3310 = drill 1.15 pad 1.725: 1 0,0; 2 2.54,0; 3 5.08,0
SOT230P700X180-4N = smd 1.35 x 0.95: 1 -3.35,2.3; 2 -3.35,0; 3 -3.35,-2.3 | smd 1.35 x 3.25: 4 3.35,0
SOT95P280X145-5N = smd 1.2 x 0.6: 1 -1.25,0.95; 2 -1.25,0; 3 -1.25,-0.95; 4 1.25,-0.95; 5 1.25,0.95
1727078 = drill 1.1 pad 1.65: 1 0,0; 2 3.81,0; 3 7.62,0; 4 11.43,0; 5 15.24,0; 6 19.05,0; 7 22.86,0; 8 26.67,0
HR911105A = drill 0.89 pad 1.446: 1 0,0; 2 -1.27,-2.54; 3 -2.54,0; 4 -3.81,-2.54; 5 -5.08,0; 6 -6.35,-2.54; 7 -7.62,0; 8 -8.89,-2.54 | drill 1.02 pad 1.53: 9 2.18,11.25; 10 -0.36,11.25; 11 -8.53,11.25; 12 -11.07,11.25 | drill 1.63 pad 2.445: MH1 3.3,3.3; MH2 -12.19,3.3 | hole 3.25: 1.27,6.35; -10.16,6.35
1727010 = drill 1.1 pad 1.65 square: 1 0,0 | drill 1.1 pad 1.65: 2 3.81,0
1727049 = drill 1.1 pad 1.65: 1 0,0; 2 3.81,0; 3 7.62,0; 4 11.43,0; 5 15.24,0
CAPC2012X90N = smd 0.96 x 1.39: 1 -0.81,0; 2 0.81,0
FE06 = drill 0.813 long: 1 -6.35,0; 2 -3.81,0; 3 -1.27,0; 4 1.27,0; 5 3.81,0; 6 6.35,0
O200JO32B1V31T1LF = smd 1.3 x 1.1: 1 -1.15,-0.95; 2 1.15,-0.95; 3 1.15,0.95; 4 -1.15,0.95
IPD031N06L3GATMA1 = smd 1.2 x 2.2: 1 -2.28,-6.3; 3 2.28,-6.3 | smd 5.8 x 6.4: 2 0,0
SOT23 = smd 1 x 1.4: 1 -0.95,-1.1; 2 0.95,-1.1; 3 0,1.1
R0603 = smd 1 x 1.1: 1 -0.85,0; 2 0.85,0
MA03-2 = drill 1.016: 1 -2.54,-1.27 | drill 1.016 octagon: 2 -2.54,1.27; 3 0,-1.27; 4 0,1.27; 5 2.54,-1.27; 6 2.54,1.27

### Placement (x,y rotation side)
C1  67.75,45.95 180 top
C2  83.85,9.85 90 bottom
C3  25.7,39.75 90 top
C4  24.4,39.75 90 top
C5  23.1,39.75 90 top
C6  21.8,39.75 90 top
C7  11.45,41.5 90 bottom
C8  11.45,45 270 bottom
C9  55.25,9.05 180 top
C10  37.65,6.6 0 top
C11  55.25,6.95 180 top
C12  60.95,16.75 90 top
C13  62.25,6.35 270 bottom
C14  64.65,6.35 270 bottom
C15  63.45,6.35 270 bottom
C16  50.85,5.95 180 top
C17  74.75,26.15 0 top
C18  74.75,31.5 0 top
C19  74.75,38.75 0 top
C20  16.05,43.25 90 bottom
C21  49.65,3.35 90 top
C22  13.95,37.25 90 bottom
C23  25.85,7.9 90 bottom
C24  25.7,28.4 90 bottom
C25  25.75,21.45 90 bottom
C26  25.75,14.6 90 bottom
C27  26.6,4.05 90 bottom
D6  71.9,42.05 180 top
D7  67.9,43.45 270 top
D8  8.05,45.8 0 bottom
IC1  40.2,34.65 0 top
IC2  60.66,10.48 90 bottom
IC3  13.1,45.75 270 top
IC4  19.5,38.6 180 bottom
IC5  26.7,4.1 180 top
IC6  25.8,7.9 180 top
IC7  25.8,14.55 180 top
IC8  25.85,21.4 180 top
IC9  25.8,28.5 180 top
J2  83.95,20.9 90 top
J3  71.35,5.15 270 top
J4  2.9,45.85 270 top
J5  3,2.2 90 top
J6  3,21.3 90 top
L1  62.65,17.75 270 bottom
PROG  39.8,4.2 180 top
Q1  56.25,3.95 0 top
Q2  13.2,5.65 90 top
Q3  13.25,12.6 90 top
Q4  13.25,19.45 90 top
Q5  13.25,26.35 90 top
Q6  13.25,33.35 90 top
Q7  72.8,23.9 90 top
Q8  68.9,23.9 270 top
Q9  72.8,29 90 top
Q10  68.9,29 270 top
Q11  72.8,36.15 90 top
Q12  68.9,36.15 270 top
R1  66.2,23.9 270 top
R2  75.8,23.9 90 top
R3  66.2,29 270 top
R4  22.75,31.05 180 top
R5  21.9,33.35 270 top
R6  71.85,43.75 0 top
R7  50.85,8.05 180 top
R8  55.15,5.45 180 bottom
R9  55.15,8.15 180 bottom
R10  37.6,7.9 0 top
R11  55.15,12.45 180 bottom
R12  56.05,16.75 90 top
R13  80.75,8.85 270 bottom
R14  80.75,11.95 90 bottom
R15  55.15,9.85 0 bottom
R16  63.95,6.55 90 top
R17  66.05,6.35 270 bottom
R18  73.85,7.35 180 bottom
R19  73.85,11.45 0 bottom
R20  73.85,9.05 0 bottom
R21  63.15,16.75 90 top
R22  71.25,1.85 180 bottom
R23  50.85,10.05 0 top
R24  51.75,3.35 270 top
R25  58.65,16.75 90 top
R26  55.15,4.15 0 bottom
R27  55.15,6.85 0 bottom
R28  55.15,11.15 0 bottom
R29  59.85,4.55 270 bottom
R30  75.75,29 90 top
R31  51.7,13 270 top
R32  22.75,3.35 180 top
R33  21.9,5.65 270 top
R34  22.75,10.35 180 top
R35  22.05,12.6 270 top
R36  22.75,17.2 180 top
R37  21.9,19.45 270 top
R38  22.75,24.05 180 top
R39  21.9,26.35 270 top
R40  66.2,36.15 270 top
R41  75.75,36.15 90 top
VIO  58.9,44.2 0 top

### Tracks (layer width: path | path; a pad name or v marks a point on that pad's centre or on a via)
+3V3  (via drill 0.35)
  Top 0.2: 67.7,37 Q12.1 | R40.1 66.1,37.1
  Top 0.254: Q1.4 55.05,4.95 53.55,4.95 53.05,4.45 v53.05,4.15 53,4.2 R24.1 51.75,5.9 C16.1 R7.1 | R25.2 58.6,17.65 57.8,17.65 57.4,17.25 57.4,15.95 56.23,15.95 56.13,15.98 R12.1 54.95,15.9 54.3,15.25 54.3,11.3 54.15,11.15 v53.25,11.15 | J3.4 66.55,11.22 66.55,15.85 v64.8,17.6 R21.2 | R25.2 58.69,17.64 | J3.9 80.85,4.72 80.85,11.75 80.35,12.25 73.37,12.25 J3.5 | Q8.1 67.7,24.75 R1.1 62.55,24.75 | Q10.1 67.7,29.85 R3.1 62.55,29.85 | R40.1 67.7,37 | 62.55,24.75 62.55,29.85 | 62.55,29.85 62.55,39.35 | 62.55,39.35 66.1,39.35 | 66.1,39.35 71.1,39.35 73.06,41.31 D6.1 | 66.1,37.1 66.1,39.35 | v40.05,7.9 R10.2 | VIO.5 62.55,41.82 62.55,39.35 | R25.2 58.65,19.65 60.3,21.3 v62.65,21.3 62.55,21.4 62.55,24.75
  Top 0.61: IC1.2 25.96,38.64 C3.1 C4.1 C5.1 C6.1 21.7,38.8 v19.45,38.8
  Bottom 0.254: 55.15,9.05 55.18,9.02 56.62,9.02 57.82,10.23 IC2.9 | 55.15,9.05 55.15,11.05 55.05,11.15 R28.2 v53.25,11.15 | 55.15,6.85 55.15,4.15 R26.2 v53.05,4.15 53,4.2 PROG.1 46.15,5.45 43.7,7.9 v40.05,7.9 | 55.15,6.85 55.15,9.05 | R27.2 55.15,6.85 | J3.4 70.08,8.96 J3.5 74.63,10.23 74.7,10.3 R19.1 R20.1 R18.2 74.7,6.4 72.1,3.8 69.35,3.8 67.65,5.5 R17.2 | v62.65,21.3 L1.1 63.49,18.56 64.45,17.6 v64.8,17.6
  Bottom 0.61: VIO.5 61.44,39.64 59.55,37.75 26.05,37.75 24.6,36.3 19.45,36.3 | 19.45,36.3 IC4.1 14.05,36.3 C22.1 | 19.45,36.3 v19.45,38.8
  Bottom 0.813: C2.1 83.85,7.6 84.55,6.9 84.55,3.92 83.6,2.97 J3.9
+5V  (via drill 0.35)
  Top 0.254: IC9.5 v24.55,26.7 | v25.45,2.32 IC5.5 | v23.4,6.95 IC6.5 | v24.55,12.75 IC7.5 | IC8.5 24.55,20.4 v24.55,19.6
  Bottom 0.254: v25.45,2.32 25.45,2.2 | 24.55,12.8 v24.55,12.75
  Bottom 0.305: 11.47,40.67 11.47,16.48 15.2,12.75 v24.55,12.75 24.55,7 | 24.55,20.55 v24.55,26.7 25.55,26.7 25.7,26.85 C24.1 | 24.55,20.55 v24.55,19.6 24.55,12.8 25.5,12.8 25.75,13.05 C26.1 | 24.55,7 24.55,3.22 v25.45,2.32 26.42,2.32 26.6,2.5 C27.1 | 24.55,7 25.8,7 C23.1 | v23.4,6.95 24.5,6.95 24.55,7 | C25.1 25.7,20.55 24.55,20.55
  Bottom 0.61: IC3.3 15.92,40.67 IC4.3 16.05,41 C20.1 23.25,42.4 26.55,39.1 57.2,39.1 58.9,40.8 VIO.3
  Bottom 0.813: C7.1 11.47,40.67 IC3.3
+24V
  Bottom 0.61: D8.1 11.4,45.8 C8.1 | VIO.1 56.4,42.89 56.4,41.25 55.55,40.4 27.15,40.4 21.8,45.75 IC3.1
  Bottom 0.813: IC3.1 13,45.85 C8.1
+UB
  Bottom 0.61: J4.1 6.45,45.85 D8.2
  Bottom 1.016: J5.1 5.85,2.2 6.55,2.9 6.55,9.85 | 6.55,9.85 6.55,17.05 | 6.55,17.05 6.55,24.85 | 6.55,24.85 6.55,32.7 | 6.55,32.7 6.55,45.75 D8.2 | J6.4 6.52,32.73 6.55,32.7 | J6.2 6.29,25.11 6.55,24.85 | J5.5 6.16,17.44 6.55,17.05 | J5.3 6.52,9.82 6.55,9.85
ADC  (via drill 0.35)
  Top 0.152: R6.1 70.95,43.8 70.6,43.45 | 70.79,44.96 70.79,42.1 D6.2 | D7.C 69,43.45 68.9,43.35
  Top 0.254: IC1.4 27.85,36.1 v27.5,36.45 | R6.1 70.74,43.49 D6.2 | C1.1 69.8,45.95 70.79,44.96 | 69,43.45 70.6,43.45 | v68.9,41.55 68.9,43.35
  Bottom 0.254: v27.5,36.45 32.85,36.45 34.3,35 65.25,35 68.9,38.65 v68.9,41.55
AI_01
  Top 0.152: J2.7 R6.2
CLKIN  (via drill 0.35)
  Top 0.152: R31.2 R23.2
  Top 0.254: R23.2 51.9,10.25 57.25,10.25 59.95,7.55 59.95,5.75 v59.91,5.75
  Bottom 0.254: IC2.5 v59.91,5.75 59.91,5.46 R29.1
CRS
  Bottom 0.254: R11.2 R28.1 56.08,11.23 IC2.11
ETH_CRS_DV  (via drill 0.35)
  Top 0.254: v37.46,26.2 31.96,26.2 IC1.12
  Bottom 0.254: R11.1 54.25,12.5 44,12.5 37.91,18.59 37.91,25.75 v37.46,26.2
ETH_MDC  (via drill 0.35)
  Top 0.254: IC1.37 52.71,38.64 61.25,30.1 v61.25,30.05
  Bottom 0.254: IC2.13 58.71,12.43 57.91,13.23 57.91,14.13 57.91,28.66 59.3,30.05 v61.25,30.05
ETH_MDIO  (via drill 0.35)
  Top 0.254: IC1.30 54.05,29.75 56.05,27.75 v56.05,18.85 R12.2
  Bottom 0.152: 56.05,18.4 v56.05,18.85
  Bottom 0.254: 56.05,18.4 56.05,14.25 57.45,12.85 57.45,12.15 57.87,11.73 IC2.12
ETH_PHY_PWR
  Top 0.254: Q1.1 52.25,3 R24.2 C21.1
ETH_RXD0  (via drill 0.35)
  Top 0.254: IC1.10 31.97,28.75 v35.55,28.75
  Bottom 0.254: v35.55,28.75 35.55,19.7 47.1,8.15 R9.1
ETH_RXD1  (via drill 0.35)
  Top 0.254: v34.33,27.48 34.06,27.21 IC1.11
  Bottom 0.254: R8.1 48.5,5.45 34.33,19.62 v34.33,27.48
ETH_TXD0  (via drill 0.35)
  Top 0.254: IC1.31 54.83,31.02 59.2,26.65 60.45,26.65 v60.5,26.7
  Bottom 0.254: IC2.17 61.41,15.09 60.5,16 v60.5,26.7
ETH_TXD1  (via drill 0.35)
  Top 0.254: v61.25,28.75 61.22,28.75 52.6,37.37 IC1.36
  Bottom 0.254: IC2.18 61.91,15.29 61.91,15.53 61.28,16.16 61.28,28.72 v61.25,28.75
ETH_TXEN  (via drill 0.35)
  Top 0.254: IC1.33 53.89,33.56 59.65,27.8 v59.7,27.8
  Bottom 0.254: IC2.16 60.91,14.79 59.7,16 v59.7,27.8
GND  (via drill 0.35, 1.5)
  other vias: 60.65,10.45 67.6,4.2 69,1.85 53,9.1 53.05,7 48.2,9.15 48.2,7.1 27.1,16.35 27.2,23.2 26.95,30.35 27.05,9.7 29.25,5.05
  pour Bottom: 0.1,50.4 0.1,0 86.4,0 86.4,50.8 52.8,50.8 52.8,41.8 27.2,41.8 27.2,50.4
  pour Top: 0.1,50.5 0.1,0 86.4,0 86.4,50.8 52.85,50.8 52.85,41.8 27.2,41.8 27.2,50.5
INPUT_01  (via drill 0.35)
  Top 0.254: IC1.7 27.96,32.29 26.4,33.85 v26.2,33.85 | v64.2,23 64.25,23.05 R1.2 67.7,23.05 Q8.2
  Bottom 0.152: v64.2,23 64.2,23.05
  Bottom 0.254: v26.2,33.85 27.1,32.95 60.15,32.95 62.6,30.5 62.6,24.6 v64.2,23
INPUT_02  (via drill 0.35)
  Top 0.254: IC1.6 27.99,33.56 v27.88,33.67 | v64.1,28.15 R3.2 66.3,28.05 Q10.2
  Bottom 0.254: v27.88,33.67 61.58,33.67 64.1,31.15 v64.1,28.15
INPUT_03  (via drill 0.35)
  Top 0.254: IC1.5 26.82,34.83 v26.25,35.4 | v66.2,33.3 R40.2 67.7,35.3 Q12.2
  Bottom 0.254: v26.25,35.4 32.4,35.4 33.4,34.4 65.1,34.4 v66.2,33.3
INT  (via drill 0.35)
  Top 0.254: R25.1 v58.65,14.05
  Bottom 0.254: IC2.14 59.91,13.19 59.05,14.05 v58.65,14.05
IO0
  Top 0.254: 50,7.85 R7.2 R23.1 50,18 48.7,19.3 48.7,20.1 | 48.7,20.1 IC1.25 | PROG.6 33.45,13.95 39.6,20.1 48.7,20.1
IO01  (via drill 0.35)
  Top 0.254: IC1.35 46.05,36.1 42.6,32.65 42.6,28.15 v41.8,27.35 | v41.85,18.5 41.85,12.95 41.07,12.17 PROG.3
  Bottom 0.254: v41.8,27.35 41.85,27.3 v41.85,18.5
IO03  (via drill 0.35)
  Top 0.254: v43.62,18.57 v43.61,18.56 PROG.2 | v43.6,27.35 43.6,32.35 46.08,34.83 IC1.34
  Bottom 0.254: v43.62,18.57 43.62,27.32 v43.6,27.35
IO17
  Top 0.254: IC1.28 50.44,27.21 51.7,25.95 R31.1
N$1
  Top 0.152: 23.57,3.38 R32.1
  Top 0.254: IC5.4 24.15,5.05 23.6,4.5 R32.1
N$2  (via drill 0.35)
  Top 0.254: v64.45,12.75 64.45,10.25 68.25,6.45 68.78,6.45 J3.2
  Bottom 0.254: IC2.20 63.53,11.23 64.45,12.15 v64.45,12.75 | R17.1 66.83,7.2 67.61,6.42 J3.2
N$3
  Bottom 0.254: IC2.22 67.43,10.23 68.7,11.5 J3.6 72.95,11.5 R19.2
N$4
  Bottom 0.254: IC2.23 65.87,9.73 67.95,7.65 71.31,7.65 J3.3 71.35,7.9 72.5,9.05 R20.2
N$5
  Bottom 0.254: R14.2 80.75,15.45 81.52,16.22 J3.12
N$6
  Bottom 0.254: R13.2 80.75,6.05 81.29,5.51 J3.10
N$7
  Top 0.254: IC6.4 23.85,8.85 23.6,9.1 R34.1
N$8  (via drill 0.35)
  Top 0.254: Q1.3 58.1,4.9 58.75,4.25 v58.75,3.85
  Bottom 0.254: v58.75,3.85 59.7,3.85 R29.2
N$9  (1 unrouted)
  Bottom 0.813: R22.2 J3.MH1
N$10
  Top 0.254: IC7.4 23.85,15.5 23.6,15.75 R36.1
N$11
  Top 0.254: Q6.1 21.9,31.07 R5.2 R4.2
N$12
  Top 0.254: Q2.1 21.88,3.37 R32.2 R33.2
N$13
  Top 0.254: Q8.3 Q7.3
N$14
  Top 0.254: Q10.3 Q9.3
N$15
  Top 0.254: Q3.1 21.87,10.32 R34.2 22.05,10.5 R35.2
N$16
  Top 0.254: 75.65,24.85 Q7.2 C17.1 | 75.65,24.85 75.7,24.85 R2.2 | J2.2 75.79,24.71 75.65,24.85
N$17
  Top 0.254: R38.1 23.6,22.6 23.85,22.35 IC8.4
N$18  (via drill 0.35)
  Top 0.254: v63.25,13.35 63.25,8.95 62.75,8.45 v62.75,8.55
  Bottom 0.254: IC2.1 62.43,8.53 62.45,8.55 v62.75,8.55 | v62.75,8.55 62.95,8.55 63.45,8.05 C15.1 | C13.1 C15.1 | C15.1 C14.1 | IC2.19 62.61,13.25 | 62.61,13.25 62.61,16.9 L1.2 | 62.61,13.25 62.71,13.35 v63.25,13.35 | v62.75,8.55
N$19  (via drill 0.35)
  Top 0.254: v59.15,6.65 58.85,6.95 C11.1 C9.1
  Bottom 0.254: IC2.6 59.41,6.91 v59.15,6.65
N$20
  Bottom 0.254: IC2.2 61.41,4.49 62.65,3.25 73.15,3.25 73.35,3.45 73.66,3.75 79.61,9.7 R13.1
N$21  (via drill 0.35)
  Top 0.254: v79.45,11.05 79.45,10.24 72.45,3.25 67.85,3.25 v66.95,2.35
  Bottom 0.254: IC2.3 60.91,3.89 62.45,2.35 v66.95,2.35 | v79.45,11.05 79.5,11.1 R14.1
N$22
  Bottom 0.254: IC2.10 57.43,10.73 56.55,9.85 R15.1
N$23  (via drill 0.35)
  Top 0.254: v65.36,12.95 65.36,10.44 68.1,7.7 69.6,7.7 70.25,7.05 70.25,6.25 J3.1
  Bottom 0.254: IC2.21 64.03,10.73 65.35,12.05 v65.35,12.95 v65.36,12.95 | R18.1 73,5.85 72.3,5.15 J3.1
N$24  (via drill 0.35)
  Top 0.254: R16.2 v63.95,8.65
  Bottom 0.254: IC2.24 63.37,9.23 v63.95,8.65
N$25
  Top 0.254: Q4.1 21.87,17.17 R36.2 R37.2
N$26
  Top 0.254: 75.72,29.88 75.65,29.95 Q9.2 C18.1 | 75.72,29.88 R30.2 | J2.3 78.23,28.52 76.88,29.88 75.72,29.88
N$28
  Top 0.254: Q5.1 21.88,24.07 R38.2 R39.2
N$29
  Top 0.254: Q12.3 Q11.3
N$30
  Top 0.2: Q11.2 75.65,37.1 R41.2
  Top 0.254: J2.6 80.95,39.95 78,37 R41.2 | Q11.2 C19.1
N$32
  Top 0.254: R4.1 23.6,29.65 23.8,29.45 IC9.4
NRST  (via drill 0.35)
  Top 0.254: v60.05,14.45 60.85,14.45 60.95,14.55 C12.1 R21.1
  Bottom 0.254: IC2.15 60.41,13.59 60.05,13.95 v60.05,14.45
REL_CH_00
  Top 0.254: IC5.2 29.9,4.1 31.6,5.8 31.6,14.3 35.76,18.45 IC1.16
REL_CH_01
  Top 0.254: IC6.2 28.5,7.9 30,9.4 30,23.95 30.72,24.67 IC1.13
REL_CH_02
  Top 0.152: 31.7,29.8 IC1.9
  Top 0.254: IC7.2 28.4,14.55 29.3,15.45 29.3,29.1 29.95,29.75 IC1.9
REL_CH_03
  Top 0.254: IC8.2 28.3,21.4 28.8,21.9 28.8,29.9 29.92,31.02 IC1.8
REL_CH_04  (via drill 0.35)
  Top 0.254: IC1.26 46.08,24.67 v45.75,25 | IC9.2 26.25,28.5 25.85,28.9 25.85,31.25 26.15,31.55 v26.15,32.35
  Bottom 0.254: v26.15,32.35 45.75,32.35 v45.75,25
REL_OUT_CH_00
  Top 1.016: Q2.2 12.79,6.06 3.05,6.06 J5.2
REL_OUT_CH_01
  Top 1.016: Q3.2 12.6,12.6 12.4,12.8 12.75,13.15 12.22,13.68 3.05,13.68 J5.4
REL_OUT_CH_02
  Top 1.016: 12.5,21.3 14.45,19.35 13.62,18.52 13.25,18.9 Q4.2 11.4,21.3 J6.1
REL_OUT_CH_03
  Top 1.016: Q5.2 7.8,26.35 5.23,28.92 J6.3
REL_OUT_CH_04
  Top 1.016: J6.5 5.91,36.54 9.1,33.35 Q6.2
RST  (via drill 0.35)
  Top 0.254: PROG.5 35.99,5.79 C10.1 36.75,6.65 R10.1 36.75,9.65 39.55,12.45 v39.55,18.5 | v34.4,30.8 34.4,36.35 33.38,37.37 IC1.3
  Bottom 0.254: v34.4,30.8 37.15,30.8 39.55,28.4 v39.55,18.5
RXD0
  Bottom 0.254: R27.1 R9.2 56.9,8.15 57.35,8.6 57.35,9.15 57.93,9.73 IC2.8
RXD1
  Bottom 0.254: R26.1 R8.2 56.75,5.45 58.71,7.41 IC2.7
VCCIO  (via drill 0.35)
  Top 0.254: R2.1 75.7,22.95 Q7.1 73.9,21.6 74.6,20.9 J2.1 | Q9.1 75.65,28.05 R30.1 76.75,28.15 v77.4,27.5 | Q11.1 75.65,35.2 R41.1 83.11,35.3 J2.5
  Bottom 0.254: v77.4,27.5 79.7,27.5 79.75,27.45
  Bottom 0.61: J2.1 80.75,20.9 79.75,21.9 79.75,27.45 79.75,36.14 | 79.75,36.14 J2.5 | VIO.2 VIO.4 VIO.6 76.83,45.47 79.75,42.55 79.75,36.14

### Text on the board
tNames: +24V | GND | GND | AIN | 24V / / 5.0V / / 3.3V | IN03 | O5 | VIO | + | Select / Input / Level | GND | O4 | IN02 | + | IN01 | O3 | VIO | + | O2 | + | O1 | 1. VCC / 2. RxD / 3. TxD / 4. GND / 5. RES / 6. FLASH | +